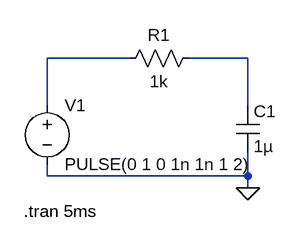
[diagram p0: schematic RC_Circuit.asc]
RC_Circuit.asc, the LTspice schematic file:
Version 4.1
SHEET 1 880 680
WIRE -32 -720 -144 -720
WIRE 128 -720 48 -720
WIRE -144 -656 -144 -720
WIRE 128 -656 128 -720
WIRE -144 -560 -144 -576
WIRE 128 -560 128 -592
WIRE 128 -560 -144 -560
WIRE 128 -544 128 -560
FLAG 128 -544 0
SYMBOL voltage -144 -672 R0
WINDOW 123 0 0 Left 0
WINDOW 39 24 44 Left 2
SYMATTR InstName V1
SYMATTR Value PULSE(0 1 0 1n 1n 1 2)
SYMBOL res 64 -736 R90
WINDOW 0 0 56 VBottom 2
WINDOW 3 32 56 VTop 2
SYMATTR InstName R1
SYMATTR Value 1k
SYMBOL cap 112 -656 R0
SYMATTR InstName C1
SYMATTR Value 1µ
TEXT -176 -512 Left 2 !.tran 5ms

The netlist it stands for:
* RC_Circuit.asc
V1 N001 0 PULSE(0 1 0 1n 1n 1 2)
R1 N002 N001 1k
C1 N002 0 1µ
.tran 5ms
.backanno
.end